# EAGLE schematic SolarPwrOption_ssr (EAGLE 7.6.0)
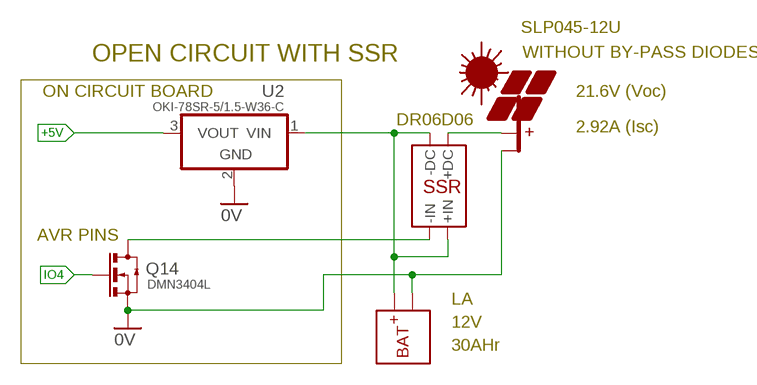
[diagram p0: schematic, sheet 1]

## Parts
PV3  PV  [NA-30]
Q14  DMN3404L  N-CHDPAK  [DPAK]
U2  OKI-78SR-5/1.5-W36-C  OKI-78SR-H  [OKI-78SR-H]
U$2  BAT  [NA-30]
U$3  SSR_DC  [NA-30]

## Nets
0V: PV3.2(-PV) Q14.3(S) U2.2(GND) U$2.2(-BAT)
+5V: U2.3(VOUT)
IO4: Q14.1(G)
N$6: U2.1(VIN) U$2.1(+BAT) U$3.2(+IN) U$3.3(-DC)
N$9: Q14.SINK(D) U$3.4(-IN)
N$10: PV3.1(+PV) U$3.1(+DC)

## Notes on the sheet
- SLP045-12U
- OPEN CIRCUIT WITH SSR | WITHOUT BY-PASS DIODES
- ON CIRCUIT BOARD | 21.6V (Voc)
- DR06D06
- 2.92A (Isc)
- AVR PINS
- LA
- 12V
- 30AHr

## Library data of the parts
PV3 = Documentation:PV
Q14 = Q-NCH:N-CH?*: ENHANCEMENT MODE MOSFET SOT23 is BSS138 pinout
U2 = P-DCDC:OKI-78SR: OKI-78SR OKI-78SR-5/1.5-W36H-C 5V@1.5A Horizontal Mount OKI-78SR-5/1.5-W36-C 5V@1.5A Vert Mount OKI-78SR-3.3/1.5-W36H-C 3.3V@1.5A Horizontal Mount OKI-78SR-3.3/1.5-W36-C 3.3V@1.5A Vert Mount Murata Power Solutions 7 to 36 VDC input range need to verify pinout
U$2 = Documentation:BAT
U$3 = Documentation:SSR_DC: Crydom DR06D06 din mount 6A 4..32VIN 60Vload